# EAGLE schematic main (EAGLE 9.5.2)
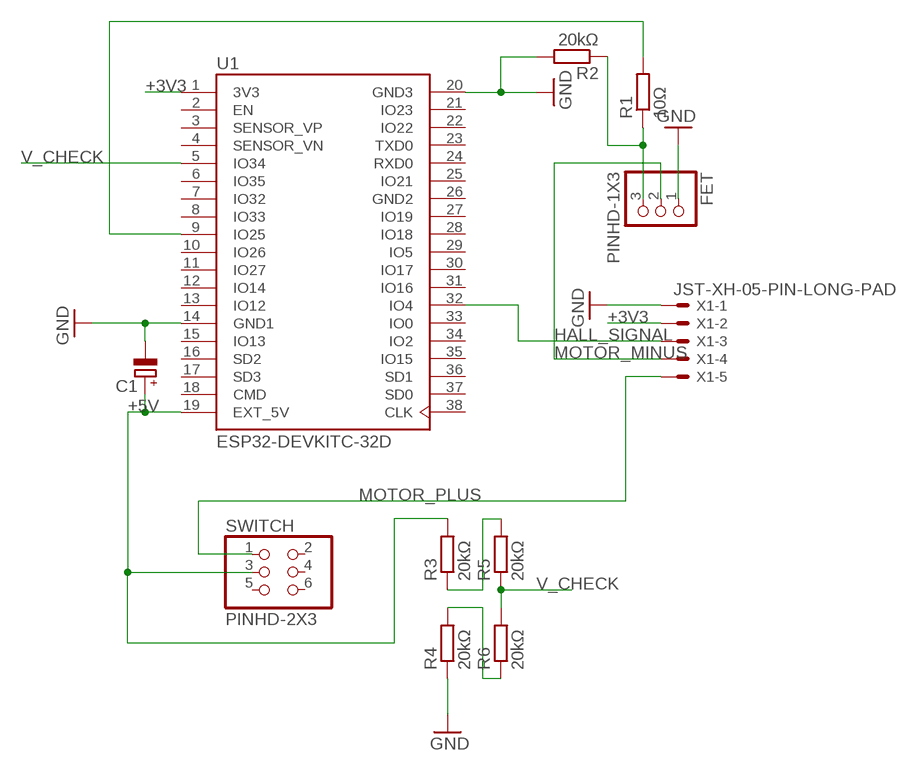
[diagram p0: schematic, sheet 1]

## Parts
C1  CPOL-EUE5-10.5  [E5-10,5]
FET  PINHD-1X3  [1X03]
R1  10Ω  R-EU_0207/10  [0207/10]
R2  20kΩ  R-EU_0207/10  [0207/10]
R3  20kΩ  R-EU_0207/10  [0207/10]
R4  20kΩ  R-EU_0207/10  [0207/10]
R5  20kΩ  R-EU_0207/10  [0207/10]
R6  20kΩ  R-EU_0207/10  [0207/10]
SWITCH  PINHD-2X3  [2X03]
U1  ESP32-DEVKITC-32D  [MODULE_ESP32-DEVKITC-32D]
X1  JST-XH-05-PIN-LONG-PAD  [JST-XH-05-PACKAGE-LONG-PAD]

## Nets
+3V3: U1.1(3V3) X1.2
+5V [wide]: C1.+ R3.2 SWITCH.3 U1.19(EXT_5V)
GND: C1.- FET.1 R2.2 R4.1 U1.14(GND1) U1.20(GND3) X1.1
HALL_SIGNAL: U1.32(IO4) X1.3
MOTOR_MINUS: FET.2 X1.4
MOTOR_PLUS: SWITCH.1 X1.5
N$2: FET.3 R1.1 R2.1
N$3: R1.2 U1.9(IO25)
N$5: R3.1 R5.2
N$8: R4.2 R6.1
V_CHECK: R5.1 R6.2 U1.5(IO34)
Unconnected: SWITCH.2 SWITCH.4 SWITCH.5 SWITCH.6 U1.2(EN) U1.3(SENSOR_VP) U1.4(SENSOR_VN) U1.6(IO35) U1.7(IO32) U1.8(IO33) U1.10(IO26) U1.11(IO27) U1.12(IO14) U1.13(IO12) U1.15(IO13) U1.16(SD2) U1.17(SD3) U1.18(CMD) U1.21(IO23) U1.22(IO22) U1.23(TXD0) U1.24(RXD0) U1.25(IO21) U1.27(IO19) U1.28(IO18) U1.29(IO5) U1.30(IO17) U1.31(IO16) U1.33(IO0) U1.34(IO2) U1.35(IO15) U1.36(SD1) U1.37(SD0) U1.38(CLK)

## Power pins joined to a net without a drawn wire
GND2: U1.26(GND2)

## Library data of the parts
C1 = rcl:CPOL-EU: POLARIZED CAPACITOR, European symbol; SPICEPREFIX: C
FET = Connector:PINHD-1X3: PIN HEADER; CATEGORY: CONNECTOR; SUB-CATEGORY: PIN-HEADER
R1-R6 = resistor:R-EU_: RESISTOR, European symbol
SWITCH = Connector:PINHD-2X3: PIN HEADER; CATEGORY: CONNECTOR; SUB-CATEGORY: PIN-HEADER
U1 = ESP32-DEVKITC-32D:ESP32-DEVKITC-32D: Eval Board For Esp-Wroom-32; MANUFACTURER: Espressif Systems; PARTREV: 4
X1 = Rembrandt Electronics - JST XH Connectors v1-0:JST-XH-05-PIN: JST XH Connector 2 Pin Wire to board connector. Pitch: 2,54 mm, (0.100") Number of pins: 5 Created by Rembrandt Electronics www.rembrandtelectronics.com

## Net classes
0 default: width 0.762 mm, clearance 0.762 mm
1 wide: width 1.016 mm, clearance 1.016 mm